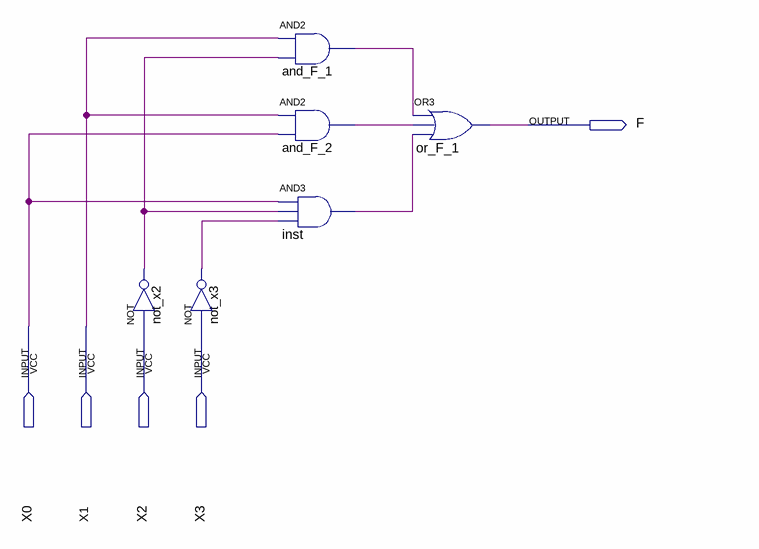
[diagram p0: schematic sheet]
// Quartus schematic dec_segmento_F.bdf as structural Verilog: 6 symbols, 5 pins
module dec_segmento_F (
  input  X0,
  input  X1,
  input  X2,
  input  X3,
  output F
);

  wire and_F_1_out, and_F_2_out, inst_out, not_x2_out, not_x3_out;

  not not_x2 (not_x2_out, X2);
  not not_x3 (not_x3_out, X3);
  and and_F_1 (and_F_1_out, X1, not_x2_out);
  and and_F_2 (and_F_2_out, X1, X0);
  and inst (inst_out, X0, not_x2_out, not_x3_out);
  or or_F_1 (F, and_F_1_out, and_F_2_out, inst_out);
endmodule
